# EAGLE board Adafruit Proto Tripler PiCowbell (EAGLE 9.6.2)
REV: A
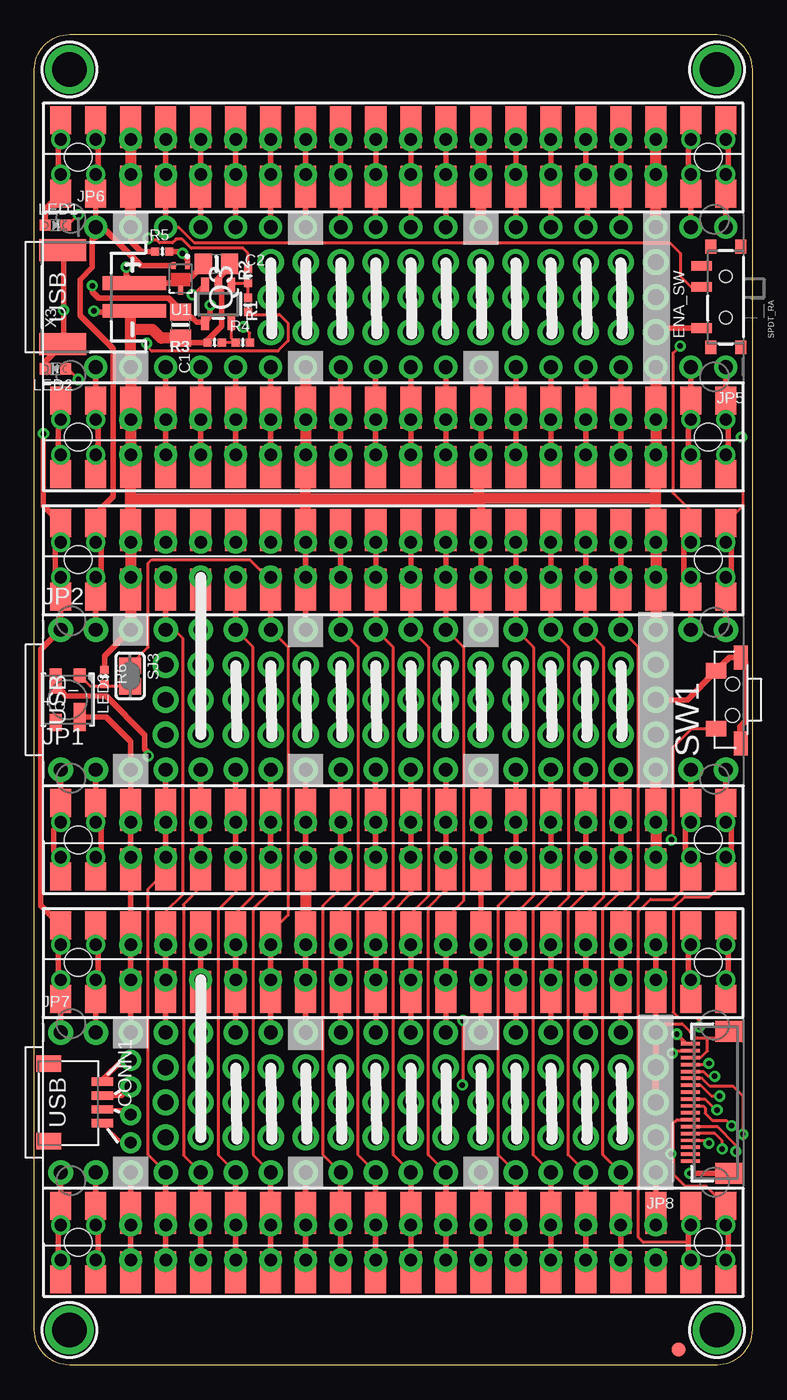
[diagram p1: board, top side]
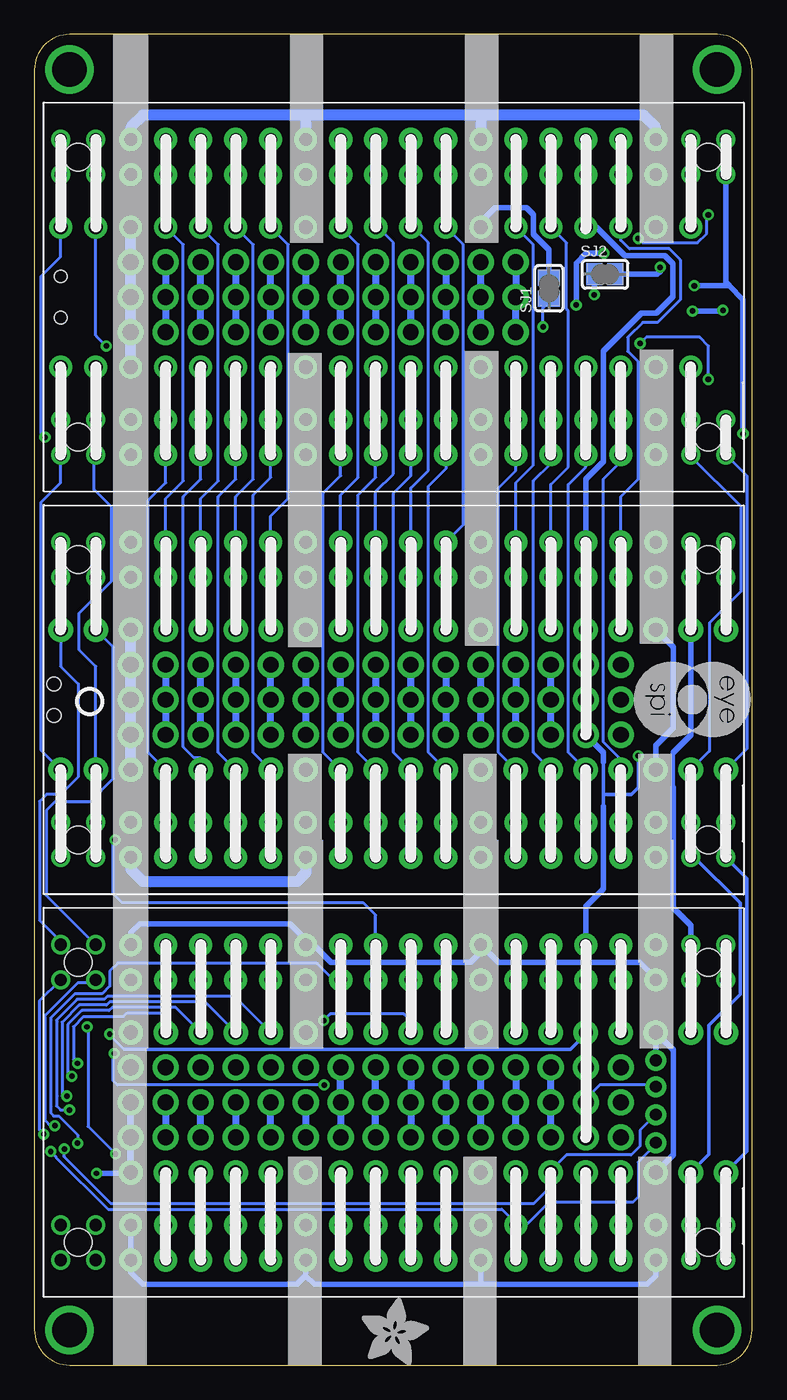
[diagram p2: board, bottom side, seen from below]

Size 52.07 x 96.52 mm. Coordinates in mm from the lower left corner, seen from the top.
Outline: 49.53,0 2.54,0 arc-90 0,2.54 0,93.98 arc-90 2.54,96.52 49.53,96.52 arc-90 52.07,93.98 52.07,2.54 arc-90 49.53,0
Copper layers (1*16): Top 0.035mm / dielectric 1.5mm / Bottom 0.035mm
Design rules "adafruit": minimum track width 8mil, minimum drill 15.5mil, track to track 8mil, track to pad 8mil, pad to pad 8mil, via to via 8mil, smd to smd 8mil, copper to edge 10mil, drill to drill 8mil, minimum pad ring 10mil, minimum via ring 8mil, stop-mask expansion 2mil, vias tented up to drill 20mil, thermal gap 10mil
Net classes: 1 GND: width 0.406 mm; 2 VBUS: width 0.406 mm; 3 VSYS: width 0.406 mm; 4 3V: width 0.406 mm

## Footprints (pad centres in the part's own frame; a part is rotated, then mirrored left to right if it is on the bottom)
0805-NO = smd 1.24 x 1.5: 1 -0.95,0; 2 0.95,0
PICOWBELL_DUALSMTTHM = smd 1.524 x 2.032: S1 -24.13,-12.829; S2 -24.13,-7.495; S3 -21.59,-12.829; S4 -21.59,-7.495; S37 21.59,-12.829; S38 21.59,-7.495; S39 24.13,-12.829; S40 24.13,-7.495; S41 24.13,12.829; S42 24.13,7.495; S43 21.59,12.829; S44 21.59,7.495; S77 -21.59,7.495; S78 -21.59,12.829; S79 -24.13,7.495; S80 -24.13,12.829 | smd 1.524 x 3.048: S5 -19.05,-12.321; S6 -19.05,-8.003; S7 -16.51,-12.321; S8 -16.51,-8.003; S9 -13.97,-12.321; S10 -13.97,-8.003; S11 -11.43,-12.321; S12 -11.43,-8.003; S13 -8.89,-12.321; S14 -8.89,-8.003; S15 -6.35,-12.321; S16 -6.35,-8.003; S17 -3.81,-12.321; S18 -3.81,-8.003; S19 -1.27,-12.321; S20 -1.27,-8.003; S21 1.27,-12.321; S22 1.27,-8.003; S23 3.81,-12.321; S24 3.81,-8.003; S25 6.35,-12.321; S26 6.35,-8.003; S27 8.89,-12.321; S28 8.89,-8.003; S29 11.43,-12.321; S30 11.43,-8.003; S31 13.97,-12.321; S32 13.97,-8.003; S33 16.51,-12.321; S34 16.51,-8.003; S35 19.05,-12.321; S36 19.05,-8.003; S45 19.05,8.003; S46 19.05,12.321; S47 16.51,8.003; S48 16.51,12.321; S49 13.97,8.003; S50 13.97,12.321; S51 11.43,8.003; S52 11.43,12.321; S53 8.89,8.003; S54 8.89,12.321; S55 6.35,8.003; S56 6.35,12.321; S57 3.81,8.003; S58 3.81,12.321; S59 1.27,8.003; S60 1.27,12.321; S61 -1.27,8.003; S62 -1.27,12.321; S63 -3.81,8.003; S64 -3.81,12.321; S65 -6.35,8.003; S66 -6.35,12.321; S67 -8.89,8.003; S68 -8.89,12.321; S69 -11.43,8.003; S70 -11.43,12.321; S71 -13.97,8.003; S72 -13.97,12.321; S73 -16.51,8.003; S74 -16.51,12.321; S75 -19.05,8.003; S76 -19.05,12.321 | drill 0.9 pad 1.27: T1 -24.13,-11.43; T2 -24.13,-8.89; T3 -21.59,-11.43; T4 -21.59,-8.89; T37 21.59,-11.43; T38 21.59,-8.89; T39 24.13,-11.43; T40 24.13,-8.89; T41 24.13,11.43; T42 24.13,8.89; T43 21.59,11.43; T44 21.59,8.89; T77 -21.59,11.43; T78 -21.59,8.89; T79 -24.13,11.43; T80 -24.13,8.89 | drill 0.9 pad 1.676: T5 -19.05,-11.43; T6 -19.05,-8.89; T7 -16.51,-11.43; T8 -16.51,-8.89; T9 -13.97,-11.43; T10 -13.97,-8.89; T11 -11.43,-11.43; T12 -11.43,-8.89; T13 -8.89,-11.43; T14 -8.89,-8.89; T15 -6.35,-11.43; T16 -6.35,-8.89; T17 -3.81,-11.43; T18 -3.81,-8.89; T19 -1.27,-11.43; T20 -1.27,-8.89; T21 1.27,-11.43; T22 1.27,-8.89; T23 3.81,-11.43; T24 3.81,-8.89; T25 6.35,-11.43; T26 6.35,-8.89; T27 8.89,-11.43; T28 8.89,-8.89; T29 11.43,-11.43; T30 11.43,-8.89; T31 13.97,-11.43; T32 13.97,-8.89; T33 16.51,-11.43; T34 16.51,-8.89; T35 19.05,-11.43; T36 19.05,-8.89; T45 19.05,11.43; T46 19.05,8.89; T47 16.51,11.43; T48 16.51,8.89; T49 13.97,11.43; T50 13.97,8.89; T51 11.43,11.43; T52 11.43,8.89; T53 8.89,11.43; T54 8.89,8.89; T55 6.35,11.43; T56 6.35,8.89; T57 3.81,11.43; T58 3.81,8.89; T59 1.27,11.43; T60 1.27,8.89; T61 -1.27,11.43; T62 -1.27,8.89; T63 -3.81,11.43; T64 -3.81,8.89; T65 -6.35,11.43; T66 -6.35,8.89; T67 -8.89,11.43; T68 -8.89,8.89; T69 -11.43,11.43; T70 -11.43,8.89; T71 -13.97,11.43; T72 -13.97,8.89; T73 -16.51,11.43; T74 -16.51,8.89; T75 -19.05,11.43; T76 -19.05,8.89 | hole 2: -22.86,-10.16; 22.86,-10.16; 22.86,10.16; -22.86,10.16
JST_SH4 = smd 0.6 x 1.55: 1 -1.5,2.006; 2 -0.5,2.006; 3 0.5,2.006; 4 1.5,2.006 | smd 1.2 x 1.8: MT1 -2.8,-1.894; MT2 2.8,-1.894
SPDT_SMT_SSSS811101 = smd 0.7 x 1.5: A -2.25,1.242; B 0.75,1.242; C 2.25,1.242 | smd 1 x 0.8: SUP1 -3.65,0.592; SUP2 -3.65,-1.608; SUP3 3.65,0.592; SUP4 3.65,-1.608 | hole 0.9: -1.5,-0.508; 1.5,-0.508
FIDUCIAL_1MM = smd 1 x 1: 1 0,0
1X20_ROUND_70MIL = drill 1 pad 1.778: 1 -24.13,0; 2 -21.59,0; 3 -19.05,0; 4 -16.51,0; 5 -13.97,0; 6 -11.43,0; 7 -8.89,0; 8 -6.35,0; 9 -3.81,0; 10 -1.27,0; 11 1.27,0; 12 3.81,0; 13 6.35,0; 14 8.89,0; 15 11.43,0; 16 13.97,0; 17 16.51,0; 18 19.05,0; 19 21.59,0; 20 24.13,0
1X19_ROUND = drill 1 pad 1.676: 1 -22.86,0; 2 -20.32,0; 3 -17.78,0; 4 -15.24,0; 5 -12.7,0; 6 -10.16,0; 7 -7.62,0; 8 -5.08,0; 9 -2.54,0; 10 0,0; 11 2.54,0; 12 5.08,0; 13 7.62,0; 14 10.16,0; 15 12.7,0; 16 15.24,0; 17 17.78,0; 18 20.32,0; 19 22.86,0
1X18_ROUND70 = drill 1 pad 1.778: 1 -21.59,0; 2 -19.05,0; 3 -16.51,0; 4 -13.97,0; 5 -11.43,0; 6 -8.89,0; 7 -6.35,0; 8 -3.81,0; 9 -1.27,0; 10 1.27,0; 11 3.81,0; 12 6.35,0; 13 8.89,0; 14 11.43,0; 15 13.97,0; 16 16.51,0; 17 19.05,0; 18 21.59,0
CHIPLED_0603_NOOUTLINE = smd 0.8 x 0.8: A 0,-0.75; C 0,0.75
LED3535_FULLPADS = smd 1 x 0.85: 1 -1.75,0.875 | smd 1.8 x 0.85: 2 -1.35,-0.875 | smd 1.2 x 0.85: 3 1.65,-0.875 | smd 2 x 0.85: 4 1.25,0.875
DFN2015-3 = smd 0.5 x 0.31: 1 -0.95,0.5; 2 -0.95,-0.5 | smd 0.65 x 0.31: 3 0.825,0
_0402NO = smd 0.6 x 0.6: 1 -0.508,0; 2 0.508,0
SOLDERJUMPER_CLOSEDWIRE = smd 1.168 x 1.6: 1 -0.762,0; 2 0.762,0 | smd 0.635 x 0.203: WIRE 0,0
SPST_TACTILE_RA = smd 1.1 x 1.5: 1 2.1,-0.9; 2 -2.1,-0.9 | smd 1.75 x 1: MT1 3.175,0.9; MT2 -3.075,0.9 | hole 1: 1.15,0.3; -1.15,0.3
SOT23-5 = smd 0.55 x 1.2: 1 -0.95,-1.3; 2 0,-1.3; 3 0.95,-1.3; 4 0.95,1.3; 5 -0.95,1.3
MOUNTINGHOLE_2.5_PLATED = drill 2.5 pad 3.2: P$1 0,0
EYE_SPI_DISPLAY_SLIM = smd 0.25 x 1.4: 1 4.25,1.154; 2 3.75,1.154; 3 3.25,1.154; 4 2.75,1.154; 5 2.25,1.154; 6 1.75,1.154; 7 1.25,1.154; 8 0.75,1.154; 9 0.25,1.154; 10 -0.25,1.154; 11 -0.75,1.154; 12 -1.25,1.154; 13 -1.75,1.154; 14 -2.25,1.154; 15 -2.75,1.154; 16 -3.25,1.154; 17 -3.75,1.154; 18 -4.25,1.154 | smd 1.5 x 2: SUPPORT1 -5.15,-1.65; SUPPORT2 5.15,-1.65
JSTPH2_BATT = smd 1 x 4.6: 1 -1,-2.049; 2 1,-2.049 | smd 1.6 x 3.4: NC1 -3.4,3.151; NC2 3.4,3.151

## Placement (x,y rotation side)
C1  10uF  [0805-NO]  10.6,75.44 270 top
C2  10uF  [0805-NO]  13.21,79.88 0 top
CB1  PICOWBELL_DUALSMTTHM  [PICOWBELL_DUALSMTTHM]  26.04,48.26 0 top
CB2  PICOWBELL_DUALSMTTHM  [PICOWBELL_DUALSMTTHM]  26.04,77.47 0 top
CB3  PICOWBELL_DUALSMTTHM  [PICOWBELL_DUALSMTTHM]  26.04,19.05 0 top
CONN1  STEMMA_I2C_QT  [JST_SH4]  2.92,19.05 270 top
ENA_SW  SPDT_RA  [SPDT_SMT_SSSS811101]  49.66,77.47 90 top
FID2  FIDUCIAL_1MM  [FIDUCIAL_1MM]  46.74,1.14 0 top
JP1  [1X20_ROUND_70MIL]  26.04,43.18 0 top
JP2  [1X20_ROUND_70MIL]  26.04,53.34 0 top
JP5  [1X19_ROUND]  27.3,72.39 180 top
JP6  [1X19_ROUND]  27.3,82.55 0 top
JP7  [1X18_ROUND70]  23.5,24.13 0 top
JP8  [1X18_ROUND70]  23.5,13.97 180 top
LED1  ORANGE  [CHIPLED_0603_NOOUTLINE]  1.52,82.68 270 top
LED2  GREEN  [CHIPLED_0603_NOOUTLINE]  1.52,72.26 90 top
LED3  WS2812B_3535FULL  [LED3535_FULLPADS]  2.41,48.26 270 top
PLABEL0  [PLABEL0]  47.82,48.13 90 top
PLABEL1  [PLABEL1]  6.86,4.7 90 top
PLABEL2  [PLABEL2]  9.4,4.7 90 top
PLABEL3  [PLABEL3]  11.94,4.7 90 top
PLABEL4  [PLABEL4]  14.48,4.7 90 top
PLABEL5  [PLABEL5]  17.02,4.7 90 top
PLABEL6  [PLABEL6]  19.56,4.7 90 top
PLABEL7  [PLABEL7]  32.26,4.7 90 top
PLABEL8  [PLABEL8]  44.96,4.7 90 top
PLABEL9  [PLABEL9]  22.1,4.7 90 top
PLABEL10  [PLABEL10]  24.64,4.7 90 top
PLABEL11  [PLABEL11]  27.18,4.7 90 top
PLABEL12  [PLABEL12]  29.72,4.7 90 top
PLABEL13  [PLABEL13]  34.8,4.7 90 top
PLABEL14  [PLABEL14]  39.88,4.7 90 top
PLABEL15  [PLABEL15]  37.34,4.7 90 top
PLABEL16  [PLABEL16]  42.42,4.7 90 top
PLABEL36  [PLABEL36]  38.86,2.79 0 bottom
PLABEL37  [PLABEL37]  13.34,2.79 0 bottom
PLABEL38  [PLABEL38]  5.97,22.1 0 bottom
PLABEL39  [PLABEL39]  5.97,20.19 0 bottom
PLABEL40  [PLABEL40]  5.97,18.16 0 bottom
PLABEL41  [PLABEL41]  5.97,16.13 0 bottom
PLABEL42  [PLABEL42]  46.93,77.47 90 top
PLABEL43  [PLABEL43]  6.98,46.74 90 top
PLABEL44  [PLABEL44]  47.37,80.96 0 top
PLABEL45  [PLABEL45]  47.37,73.98 0 top
PLABEL48  [PLABEL48]  2.03,19.05 90 bottom
PLABEL49  [PLABEL49]  48.89,19.05 270 bottom
PLABEL50  [PLABEL50]  3.68,77.47 90 bottom
PLABEL51  [PLABEL51]  13.59,74.68 0 bottom
PLABEL52  [PLABEL52]  13.84,80.64 0 bottom
PLABEL59  [PLABEL17]  45.09,91.82 90 top
PLABEL60  [PLABEL18]  32.38,91.82 90 top
PLABEL61  [PLABEL19]  19.69,91.82 90 top
PLABEL62  [PLABEL20]  6.98,91.82 90 top
PLABEL63  [PLABEL21]  9.52,91.82 90 top
PLABEL64  [PLABEL22]  12.06,91.82 90 top
PLABEL65  [PLABEL23]  14.61,91.82 90 top
PLABEL66  [PLABEL24]  17.14,91.82 90 top
PLABEL67  [PLABEL25]  22.23,91.82 90 top
PLABEL68  [PLABEL26]  24.77,91.82 90 top
PLABEL69  [PLABEL27]  27.3,91.82 90 top
PLABEL70  [PLABEL28]  29.84,91.82 90 top
PLABEL71  [PLABEL29]  34.92,91.82 90 top
PLABEL72  [PLABEL30]  37.47,91.82 90 top
PLABEL73  [PLABEL31]  40.01,91.82 90 top
PLABEL74  [PLABEL32]  42.55,91.82 90 top
PLABEL75  [PLABEL33]  38.73,93.98 0 bottom
PLABEL76  [PLABEL34]  26.04,93.98 0 bottom
PLABEL77  [PLABEL35]  13.08,93.73 0 bottom
Q3  DMG3415UFY  [DFN2015-3]  10.6,78.8 270 top
R1  4.7K  [_0402NO]  15.49,78.99 270 top
R2  22K  [_0402NO]  15.49,76.9 90 top
R3  4.7K  [_0402NO]  13.08,74.17 180 top
R4  4.7K  [_0402NO]  15.11,74.17 0 top
R5  22K  [_0402NO]  9.27,80.77 0 top
R6  22K  [_0402NO]  5.08,49.91 270 top
SJ1  [SOLDERJUMPER_CLOSEDWIRE]  14.73,78.1 90 bottom
SJ2  [SOLDERJUMPER_CLOSEDWIRE]  10.67,79.12 0 bottom
SJ3  [SOLDERJUMPER_CLOSEDWIRE]  6.93,49.99 270 top
SW1  RA Tact  [SPST_TACTILE_RA]  50.36,48.26 270 top
U1  MCP73831T-2ACI/OT  [SOT23-5]  13.34,76.96 180 top
U$5  MOUNTINGHOLE2.5  [MOUNTINGHOLE_2.5_PLATED]  2.54,2.54 0 top
U$6  [PCBFEAT-REV-040]  48.07,48.13 180 bottom
U$7  MOUNTINGHOLE2.5  [MOUNTINGHOLE_2.5_PLATED]  49.53,2.54 0 top
U$10  [ADAFRUIT_5MM]  28.32,0 0 bottom
U$15  MOUNTINGHOLE2.5  [MOUNTINGHOLE_2.5_PLATED]  2.54,93.98 0 top
U$16  MOUNTINGHOLE2.5  [MOUNTINGHOLE_2.5_PLATED]  49.53,93.98 0 top
U$25  [EYESPI_MINI_LOGO]  8.64,51.05 270 bottom
X1  EYE_SPI_DISPLAY_SLIM  [EYE_SPI_DISPLAY_SLIM]  48.74,19.05 90 top
X3  JST_2PH  [JSTPH2_BATT]  5.21,77.47 90 top

## Tracks (layer width: path | path; a pad name or v marks a point on that pad's centre or on a via)
3.3V  (via drill 0.39, 0.85 pad 1.52, 1.14 pad 1.91)
  Top 0.305: X1.1 47.31,23.3 v46.61,24
  Top 0.406: CONN1.2 6.34,19.55 v6.98,20.19 | CB1.S71 JP2.5 | JP2.5 | CB1.S72 12.06,59.75 CB1.T71 | JP6.4 CB2.S71 | CB2.T71 CB2.S72 CB2.T72 | CB2.T71 | CB2.T72 | CB3.S71 JP7.5 | JP7.5 | LED3.2 2.25,48.51 5.21,48.51 8,45.72 8,44.7 8.25,44.45 v8.25,44.2 | CB3.S71 | CB3.S71 CB3.T71
  Top 0.813: JP2.5 | v12.06,16.51 v12.06,19.05 v12.06,21.59 JP7.5 | JP7.5 | JP2.5 v12.06,50.8
  Bottom 0.203: v6.98,20.19 7.11,20.32 11.05,20.32 12.06,19.3 v12.06,19.05 | 46.61,23.95 45.55,22.9
  Bottom 0.254: 10.79,40.51 10.79,41.4 | 10.79,41.4 10.79,43.74 | v46.61,24 46.61,23.95 | JP7.5 12.06,24 13.17,22.9 45.55,22.9 | v8.25,44.2 8.25,41.91 8.76,41.4 10.79,41.4
  Bottom 0.406: JP6.4 11.3,82.55 9.22,80.47 6.33,80.47 5.74,79.88 5.74,77.51 6.96,76.29 8.04,76.29 10.79,73.54 10.79,65.53 12.06,64.26 CB1.T71 CB1.T72 | CB3.T71 12.06,33.27 10.79,34.54 10.79,40.51 | 10.79,43.74 10.79,44.45 v12.06,45.72 v12.06,48.26 v12.06,50.8
!EN
  Top 0.203: 10.29,82.55 10.45,82.55 11.59,81.41 46.1,81.41 46.86,80.64 46.86,78.99 47.64,78.22 ENA_SW.B | CB3.S74 9.52,32.89 10.78,34.15 10.78,52.72 10.03,53.47 9.52,53.47
  Top 0.254: JP6.3 10.29,82.55
  Top 0.406: JP2.4 9.52,53.47 CB1.S73 9.52,56.32 CB1.T74 | JP2.4 | CB1.S74 9.52,59.75 CB1.T73 | CB2.T73 CB2.S74 CB2.T74 | CB2.T73 | JP6.3 9.52,84.84 9.65,84.96 9.65,85.35 CB2.S73 CB2.T74 | CB2.T74 | CB3.T73 CB3.S74 CB3.T74 | CB3.T73 | CB3.S73 JP7.4 | CB3.S73 | CB3.S73 CB3.T74 | CB3.T74
  Bottom 0.203: CB1.T73 9.52,62.99 8.25,64.26 8.25,72.77 9.02,73.53 9.02,74.55 7.94,75.63 6.86,75.63 5.21,77.28 5.21,80.17 6.01,80.97 8.9,80.97 9.52,81.6 JP6.3
  Bottom 0.406: CB1.T73 CB1.T74
!RESET  (via drill 0.39)
  Top 0.203: JP2.11 28.57,52.07 28.57,34.04 27.3,32.77 CB3.S60 | CB3.S60 | v46.23,38.1 46.36,38.23 46.36,44.83 47.68,46.16 SW1.1
  Top 0.406: JP2.11 CB1.S59 27.3,57.21 | JP2.11 | CB1.T59 27.3,60.64 CB1.S60 27.3,57.21 | 27.3,57.21 CB1.T60 | CB2.S60 CB2.T59 | CB2.T59 | CB2.S59 CB2.T60 | CB2.T60 | CB2.S59 CB2.T59 | JP6.10 | JP6.10 CB2.S59 | JP7.11 | CB3.S60 CB3.T59 | CB3.T59 | CB3.S59 | CB3.S59 CB3.T60 | CB3.S59 CB3.T59 | CB3.T59 | CB3.S59 JP7.11
  Bottom 0.203: CB1.T59 27.3,63.37 26.04,64.64 26.04,81.41 27.3,82.68 | CB3.T59 27.3,32.64 28.19,33.53 45.72,33.53 46.36,34.16 46.36,38.1 v46.23,38.1
  Bottom 0.254: JP6.10 27.3,82.68
AD0  (via drill 0.39)
  Top 0.203: JP2.10 26.02,52.08 26.02,33.9 24.77,32.64 24.77,31.62 | v31.09,24.99 31.09,22.12 31.1,22.11 31.1,20.37 v31.05,20.32 | v46.28,22.61 46.41,22.61 46.6,22.8 X1.2
  Top 0.406: CB1.S61 JP2.10 | JP2.10 | CB1.T61 24.77,60.64 CB1.S62 24.77,57.21 CB1.T62 | CB2.T61 CB2.S62 CB2.T62 | CB2.T61 | CB2.T62 | CB2.T62 CB2.S61 JP6.9 | JP7.10 | JP7.10 CB3.S61 | CB3.S61 | CB3.S61 CB3.T62 | CB3.S61 CB3.T61 | CB3.T61 | CB3.T61 CB3.S62 24.77,31.62
  Top 0.508: CB1.S61 24.77,56.32 CB1.T62
  Bottom 0.203: CB1.T61 24.77,63.63 23.5,64.9 23.5,81.41 24.64,82.55 JP6.9 | JP7.10 24.77,24.95 25.27,25.46 30.62,25.46 v31.09,24.99 | v31.05,20.32 46.04,20.32 46.38,20.66 46.38,22.5 v46.28,22.61
AD1
  Top 0.203: JP2.9 23.5,52.07 23.5,34.16 22.23,32.89 CB3.S64
  Top 0.406: CB1.S63 JP2.9 | JP2.9 | CB1.S64 22.23,60.64 CB1.T63 22.23,59.75 CB1.S63 | CB1.S63 22.23,56.32 CB1.T64 | CB2.T63 | CB2.T63 CB2.S64 CB2.T64 | CB2.T64 | CB2.T64 CB2.S63 JP6.8 | JP7.9 | CB3.T64 | 22.23,26.29 | 22.23,26.29 JP7.9 | JP7.9 | CB3.S63 22.23,26.29 | CB3.S64 CB3.T63 | CB3.T63 | CB3.S63 CB3.T64 | CB3.S63 CB3.T63
  Bottom 0.203: CB1.T63 20.95,60.96 20.95,81.28 JP6.8
AD2
  Top 0.203: JP2.7 18.41,52.07 18.41,32.64 CB3.S68 | SJ3.1 8.25,52.07 8.25,58.17 8.51,58.42 15.62,58.42 16.83,57.21 17.14,57.21
  Top 0.406: CB1.S67 JP2.7 | JP2.7 | CB1.S68 17.14,59.75 CB1.T67 | 17.14,57.21 CB1.T68 | JP6.6 | CB2.S67 JP6.6 | CB2.T67 CB2.S68 CB2.T68 | CB2.T67 | CB2.T68 | JP7.7 CB3.S67 | CB3.S67 CB3.T68 CB3.T67 | CB3.S67
  Bottom 0.203: CB1.T67 17.14,64.01 15.88,65.28 15.88,81.28 JP6.6
  Bottom 0.406: CB1.T67 CB1.T68
GND  (via drill 0.39, 0.4, 0.85 pad 1.52, 1.14 pad 1.91)
  Top 0.203: JP7.18 45.71,24.75 47,24.75 48.01,23.75 48.83,23.75 | X1.SUPPORT2 49.94,23.75 48.83,23.75 | X1.3 48.35,22.3 48.83,22.78 48.83,23.75
  Top 0.406: SW1.MT1 51.26,45.27 51.19,45.34 51.19,46.29 51.61,46.71 51.61,50.98 SW1.MT2 50.43,51.34 SW1.2 47.36,48.26 v45.09,48.26 | CB1.S6 6.98,40.2 CB1.T6 | CB1.S6 6.98,36.77 | 6.98,36.77 CB1.T5 | 6.98,36.77 CB1.S5 CB3.S76 | CB1.T16 19.69,40.2 CB1.S16 JP1.8 | CB1.T15 19.69,35.88 CB1.S15 CB1.T16 | CB1.T16 | 32.38,36.77 CB1.T25 | 32.38,36.77 CB1.S25 CB3.S56 | CB1.T36 45.09,40.2 CB1.S36 | CB1.S35 45.09,35.88 CB1.T35 | JP1.8 | CB1.S6 6.98,43.1 | CB1.S55 JP2.13 | JP2.13 | CB1.S65 JP2.8 | JP2.8 | JP2.3 | CB1.S76 6.98,59.75 CB1.T75 | 6.98,57.21 CB1.T76 | CB1.T66 19.69,57.21 19.69,59.75 | CB1.S46 45.09,59.75 CB1.T45 | 45.09,57.21 CB1.T46 | CB1.T55 32.38,59.75 CB1.S56 32.38,57.21 CB1.T56 | 19.69,59.75 19.69,59.82 CB1.S66 | 19.69,59.75 CB1.T65 | CB1.S26 32.38,40.2 CB1.T26 | CB1.S26 32.38,36.77 | CB1.S26 32.38,40.2 JP1.13 | CB2.S5 CB2.T5 | CB2.T5 | CB2.S16 | 19.69,64.52 CB2.S15 CB2.T15 | 19.69,64.52 | CB2.T15 | CB2.S16 CB2.T16 | CB2.S16 | CB2.T25 CB2.S25 CB2.T26 | CB2.T25 | CB2.S35 CB2.T35 | 6.98,84.84 7.11,84.96 7.18,84.9 7.18,85.28 CB2.S75 | CB2.S76 CB2.T75 | CB2.T75 | CB2.T65 CB2.S66 CB2.T66 | CB2.T65 | JP6.7 CB2.S65 CB2.T66 | JP6.7 | CB2.T66 | CB2.S45 CB2.T46 | CB2.T46 | CB2.T45 | CB2.S46 CB2.T45 | CB2.S26 32.38,70.1 | 32.38,70.1 | 32.38,70.1 CB2.T26 | CB2.T26 | JP5.8 32.38,70.1 | CB2.S75 | CB2.S75 CB2.T76 | CB2.T76 | C2.2 14.16,79.63 13.34,78.81 U1.2 13.59,78.01 13.59,75.37 12.57,74.36 R3.2 11.3,74.17 10.98,74.49 C1.2 | LED2.C 0.77,72.79 X3.NC1 2.12,74.13 v2.12,76.52 2.12,80.81 X3.NC2 | v4.32,76.45 4.38,76.39 6.03,76.39 6.22,76.2 6.98,76.2 | R5.1 7.75,80.77 6.98,81.53 JP6.2 | v6.98,22.1 6.35,22.1 4.93,20.67 CONN1.1 | JP8.1 | JP8.16 CB3.S6 | CB3.S6 CB3.T6 CB3.T5 | CB3.S6 | CB3.S5 CB3.T5 | CB3.T5 | CB3.T15 CB3.T16 19.69,11.56 19.81,11.68
  Top 0.406: CB3.S16 19.81,11.17 19.81,11.68 | JP8.11 19.69,11.81 19.81,11.68 | CB3.S25 CB3.T25 | CB3.S26 | CB3.S26 CB3.T26 | CB3.S26 CB3.T25 | CB3.T25 | CB3.S26 JP8.6 | JP8.6 | CB3.S36 CB3.T36 | CB3.S36 JP8.1 | CB3.T45 CB3.S46 CB3.T46 | CB3.T45 | CB3.T65 CB3.S66 CB3.T66 | CB3.T65 | CB3.T66 | CB3.T66 CB3.S65 JP7.8 | JP7.3 6.98,26.29 7.24,26.54 7.24,26.8 CB3.S75 | CB3.T55 | CB3.S56 CB3.T55 | CB3.S36 | CB3.S35 CB3.T35 | CB3.T35 | CB3.T46 | CB3.S45 | CB3.S45 CB3.T46 | CB3.S45 JP7.18 v45.09,21.59 | CB3.S55 JP7.13 | CB3.S55 | CB3.S55 CB3.T56 | CB3.S55 CB3.T55 | CB3.S15 CB3.T15 | CB3.T15 | CB3.S56 | X1.SUPPORT1 v47.57,13.9 v47.56,13.91 | CB3.S75 | CB3.S75 CB3.T76 | CB3.S76 | CB3.S76 CB3.T75 | CB3.T75 | CB3.S76 CB3.T76 | CB3.T76 | LED3.4 5.19,47.01 6.98,45.22 JP1.3 | ENA_SW.A 45.38,75.22 v45.09,74.93 | R6.1 5.08,51.43 JP2.3 | JP1.18 | JP2.18 | CB2.T6 | CB2.T56 | JP6.17
  Top 0.508: CB1.S45 45.09,56.32 CB1.T46 | CB1.S65 19.69,56.32 CB1.T66 | CB1.S75 6.98,56.32 CB1.T76 | CB1.S55 32.38,56.32 CB1.T56 | JP1.3 6.98,43.1 | 6.98,43.1 | v45.09,19.05 v45.09,21.59
  Top 0.61: CB1.S56 32.38,62.74
  Top 0.813: CB1.T36 CB1.T35 | CB1.S36 JP1.18 | CB1.S45 JP2.18 | CB1.S75 JP2.3 | CB1.S76 6.98,57.21 | 45.09,57.21 CB1.S46 45.09,62.86 | 19.69,59.82 19.69,62.86 | CB1.S76 | CB1.S76 6.98,62.86 | 6.98,62.86 19.69,62.86 | 19.69,62.86 32.26,62.86 | 32.26,62.86 32.38,62.74 | 45.09,62.86 32.26,62.86 | JP5.13 CB2.S16 | 19.69,62.86 19.69,64.52 | CB2.T16 CB2.T15 | 32.26,62.86 32.26,65.02 CB2.S25 | 45.09,62.86 CB2.S35 | CB2.S35 | JP6.2 6.98,84.84 | JP6.17 CB2.S45 CB2.T45 | CB2.S76 CB2.T76 | JP5.3 45.09,70.36 44.83,70.1 44.83,69.72 CB2.S36 | CB2.S36 CB2.T36 | CB2.T36 | CB2.S36 CB2.T35 | CB2.T35 | JP6.12 CB2.S55 CB2.T56 CB2.S56 CB2.T55 | CB2.T55 | 6.98,75.06 JP5.18 CB2.S6 CB2.T6 CB2.S5 6.98,62.86 | 6.98,75.06 6.98,76.2 X3.1 | C1.2 9.21,74.49 8.57,75.12 7.05,75.12 6.98,75.06 | CB1.S15 19.69,32.13 19.56,32 19.56,31.5 CB3.S66
  Bottom 0.406: CB1.S35 CB1.T35 | CB2.T75 CB2.S76 | CB2.S46 CB2.T45 | v2.12,76.52 2.18,76.45 v4.32,76.45 | SJ1.2 14.73,80.9 15.88,82.04 15.88,83.44 16.38,83.95 18.67,83.95 19.69,82.93 JP6.7 | CB3.T45 CB3.S46 44.45,32 33.53,32 32.38,30.86 CB3.T55 31.81,30.48 30.54,29.21 20.45,29.21 19.69,29.97 CB3.T65 18.41,29.21 8.13,29.21 6.98,28.07 CB3.T76 | 32.38,6.48 33.02,5.84 44.2,5.84 CB3.S35 CB3.T35 CB3.T36 | JP8.16 5.71,15.24 5.71,22.86 JP7.3 v6.98,22.1 | 32.38,6.48 31.75,5.85 30.66,5.85 20.07,5.84 19.81,5.84 | 32.38,6.48 CB3.T25 | 19.81,5.84 7.62,5.84 6.98,6.48 CB3.T5 | 19.81,5.84 19.69,5.97 CB3.T15 | v47.56,13.91 45.15,13.91 JP8.1 | JP2.3 5.71,52.07 5.71,46.23 6.98,44.96 JP1.3
  Bottom 0.508: v45.09,19.05 v45.09,16.51 JP8.1
  Bottom 0.813: CB1.T25 32.38,35.69 33.02,35.05 44.2,35.05 CB1.S35 | JP1.18 v45.09,45.72 v45.09,48.26 v45.09,50.8 JP2.18 | CB2.S76 7.87,90.68 19.56,90.68 | 32.26,90.68 44.2,90.68 CB2.S46 | JP5.3 v45.09,74.93 v45.09,77.47 v45.09,80.01 JP6.17 | 19.56,90.68 19.69,90.55 CB2.T65 | 19.56,90.68 32.26,90.68 | 32.26,90.68 32.38,90.55 CB2.T55
IO0
  Top 0.406: CB1.S1 1.91,36.77 CB1.T1 1.4,37.28 1.4,38.8 CB1.T2 1.91,40.2 CB1.S2 JP1.1 | JP1.1 | CB2.T1 1.91,66.52 1.72,66.71 1.72,67.91 1.91,68.1 CB2.T2 CB2.S2 | CB2.S1 CB2.T1 | CB2.T1 | CB2.S2 | CB3.S2 JP8.18 | JP8.18 | CB3.S1 CB3.T1 | CB3.T1 | CB3.T1 1.91,8.1 1.72,8.29 1.72,9.49 1.91,9.68 CB3.T2 CB3.S2 | CB3.S2
  Bottom 0.203: CB2.T1 0.38,64.52 0.38,44.7 JP1.1
  Bottom 0.254: JP8.18 0.38,15.49 0.38,35.31 CB1.T1
IO1
  Top 0.406: CB1.S4 4.45,40.2 CB1.T4 | CB1.S3 4.45,36.77 CB1.T3 4.83,37.15 4.83,40.32 CB1.S4 | CB1.S4 JP1.2 | JP1.2 | JP5.19 CB2.S4 | CB2.T3 4.45,66.52 4.63,66.71 4.63,67.91 4.45,68.1 CB2.T4 CB2.S4 | CB2.S3 CB2.T3 | CB2.T3 | CB2.S4 | CB3.S4 JP8.17 | JP8.17 | CB3.S4 CB3.T4 | CB3.T4 | CB3.S4 4.45,9.68 4.63,9.49 4.63,8.29 4.45,8.1 CB3.T3 | CB3.S3 CB3.T3 | CB3.T3
  Bottom 0.203: JP1.2 3.1,44.53 3.1,53.83 0.79,56.15 0.79,62.25 4.45,65.91 CB2.T3
  Bottom 0.254: CB1.T3 4.19,36.83 0.87,33.51 0.87,26.89 3.12,24.63 3.12,15.29 JP8.17
IO2
  Top 0.203: JP8.15 8.25,15.24 8.25,34.54 9.52,35.81 9.52,36.07
  Top 0.406: CB1.S7 9.52,36.07 9.52,36.77 | 9.52,36.77 CB1.T7 9.52,36.77 | CB1.S8 9.52,40.2 CB1.T8 | CB1.S8 9.52,36.77 | CB1.S8 JP1.4 | JP1.4 | JP5.17 CB2.S8 | CB2.S8 | CB2.S8 CB2.T8 | CB2.S8 CB2.T7 | CB2.T7 | CB2.S7 | CB2.S7 9.52,64.64 | 9.52,64.64 | 9.52,64.64 CB2.T7 | CB3.T7 CB3.S7 CB3.T8 | CB3.T7 | CB3.T8 | 9.52,11.56 9.65,11.68 9.65,11.81 9.52,11.68 9.52,11.56 | 9.52,11.56 CB3.S8 CB3.T8 | JP8.15 9.52,11.56 | 9.52,11.56
  Bottom 0.203: JP1.4 9.52,43.94 10.79,45.21 10.79,64.26 9.52,65.53 CB2.T7
IO3
  Top 0.203: JP8.14 10.81,15.23 10.81,33.41 12.06,34.67 CB1.S9
  Top 0.406: CB1.S9 12.06,36.77 CB1.T9 CB1.T10 12.06,40.2 CB1.S10 JP1.5 | JP1.5 | JP5.16 | CB2.S9 CB2.T9 | CB2.T9 | CB2.S10 | CB2.S10 CB2.T10 | CB2.S10 CB2.T9 | CB2.S10 JP5.16 | JP8.14 CB3.S10 | CB3.S10 CB3.T10 CB3.T9 CB3.S9 | CB3.S10 | CB3.S9
  Bottom 0.203: JP1.5 13.34,44.45 13.34,63.88 CB2.S9 CB2.T9
IO4  (via drill 0.39, 0.85 pad 1.52)
  Top 0.203: CONN1.3 6.47,18.55 6.86,18.16 v6.98,18.16 | CB1.S11 14.61,34.29 13.34,33.02 13.34,15.24 JP8.13 | v49.9,15.68 49.9,16.25 49.35,16.8 X1.14
  Top 0.406: CB1.T11 14.61,36.77 CB1.S11 14.61,39.31 CB1.T12 14.61,40.2 CB1.S12 JP1.6 | JP1.6 | CB2.S12 JP5.15 | CB2.S12 | CB2.S12 CB2.T12 | CB2.S12 CB2.T11 | CB2.T11 | CB2.S11 CB2.T11 | CB2.T11 | CB3.T11 CB3.S11 CB3.T12 | CB3.T11 | CB3.T12 | CB3.S12 | CB3.S12 CB3.T12 | JP8.13 CB3.S12
  Bottom 0.203: JP1.6 15.86,44.44 15.86,64.15 14.61,65.41 CB2.T11 | v6.98,18.16 8.13,17.02 8.13,15.88 8.76,15.24 13.46,15.24 14.61,14.1 JP8.13 14.61,12.95 15.85,11.71 46.5,11.71 49.9,15.11 v49.9,15.68
IO5  (via drill 0.39, 0.85 pad 1.52)
  Top 0.203: CONN1.4 6.35,16.13 v6.98,16.13 | JP8.12 15.88,15.24 15.88,33.08 17.16,34.36 | CB1.S13 17.14,36.32 | 17.14,36.32 | X1.13 49.53,17.3 50.89,15.94 v50.89,15.49
  Top 0.406: 17.14,35.88 17.14,36.32 CB1.T13 CB1.T14 17.14,40.2 CB1.S14 JP1.7 | CB1.S13 17.14,35.88 | 17.14,35.88 17.16,34.36 | JP1.7 | JP5.14 | CB2.T13 CB2.S13 CB2.T14 | CB2.T13 | CB2.T14 | CB2.T14 CB2.S14 JP5.14 | JP8.12 CB3.S14 | CB3.S14 | CB3.S14 CB3.T14 | CB3.S14 CB3.T13 | CB3.T13 | CB3.S13 CB3.T13
  Bottom 0.203: JP1.7 18.41,44.45 18.41,63.63 17.14,64.9 CB2.T13 | v6.98,16.13 6.98,16 8.25,14.73 8.25,12.19 8.64,11.81 14.73,11.81 16.38,10.16 CB3.T14 17.14,10.29 18.16,11.3 46.74,11.3 50.51,15.08 50.51,15.11 v50.89,15.49
IO6
  Top 0.203: JP8.10 20.95,15.24 20.95,33.34 22.23,34.62
  Top 0.406: 22.23,35.88 CB1.T17 CB1.T18 22.23,40.2 CB1.S18 JP1.9 | CB1.S17 22.23,35.88 | 22.23,35.88 22.23,34.62 | JP1.9 | CB2.S17 CB2.T17 | CB2.T17 | JP5.12 CB2.S18 | CB2.S18 | CB2.S18 CB2.T18 | CB2.S18 CB2.T17 | CB3.T17 CB3.T18 CB3.S18 | CB3.S18 22.35,11.17 22.35,12.06 22.23,11.94 22.23,11.68 | 22.23,11.68 CB3.S18 | JP8.10 22.23,11.68 | 22.23,11.68 | CB3.S18 | CB3.S17 CB3.T17 | CB3.T17
  Bottom 0.203: JP1.9 23.5,44.45 23.5,63.75 22.23,65.02 CB2.T17
IO7
  Top 0.203: JP8.9 23.5,15.24 23.5,33.08 24.77,34.36
  Top 0.406: CB1.S19 24.77,35.88 | 24.77,35.88 24.77,34.36 | 24.77,35.88 CB1.T19 CB1.T20 24.77,40.2 | CB1.S20 24.77,40.2 | 24.77,40.2 JP1.10 | CB2.S19 CB2.T19 | CB2.T19 | JP5.11 CB2.S20 | CB2.S20 | CB2.S20 CB2.T20 | CB2.S20 CB2.T19 | JP8.9 24.77,11.68 24.89,11.56 24.89,11.17 CB3.S20 | CB3.S20 | CB3.S20 CB3.T20 | CB3.T19 CB3.S19 CB3.T20 | CB3.T19 | CB3.T20
  Bottom 0.203: JP1.10 26.04,44.45 26.04,63.25 24.77,64.52 CB2.T19
IO8
  Top 0.203: JP8.8 26.04,15.24 26.04,32.96 27.32,34.24
  Top 0.406: 27.3,40.2 CB1.T22 | CB1.S21 27.3,35.88 | 27.3,35.88 27.32,34.24 | 27.3,35.88 CB1.T21 27.3,36.77 CB1.S22 27.3,40.2 | JP1.11 27.3,40.2 | CB2.S22 | CB2.S22 CB2.T22 | CB2.S22 CB2.T21 | CB2.T21 | CB2.S21 CB2.T21 | JP5.10 27.3,70.23 27.43,70.1 27.43,69.59 CB2.S22 | CB3.T22 | JP8.8 CB3.S22 CB3.T22 | CB3.T21 CB3.S21 CB3.T22 | CB3.T21
  Bottom 0.203: JP1.11 28.57,44.45 28.57,63.12 27.3,64.39 CB2.T21
IO9
  Top 0.203: JP8.7 28.57,15.24 28.57,33.21 29.85,34.49
  Top 0.406: CB1.S23 29.84,35.88 | 29.84,35.88 29.85,34.49 | 29.84,35.88 CB1.T23 29.84,36.77 CB1.S24 | CB1.S24 29.84,40.2 CB1.T24 | CB1.S24 JP1.12 | JP1.12 | CB2.S23 CB2.T23 | CB2.T23 | CB2.T23 | CB2.S24 JP5.9 | CB2.S24 | CB2.S24 CB2.T24 | CB2.S24 CB2.T23 | JP8.7 CB3.S24 CB3.T24 | CB3.T24 | CB3.T23 CB3.S23 CB3.T24 | CB3.T23
  Bottom 0.203: JP1.12 31.12,44.45 31.12,63.25 29.84,64.52 CB2.T23
IO10
  Top 0.203: JP8.5 33.66,15.24 33.66,33.34 34.93,34.62
  Top 0.406: 34.92,35.88 CB1.S27 34.92,39.31 CB1.T28 34.92,40.2 CB1.S28 JP1.14 | 34.92,35.88 34.93,34.62 | 34.92,35.88 CB1.T27 | JP1.14 | CB2.S27 CB2.T27 | CB2.T27 | JP5.7 CB2.S28 | CB2.S28 | CB2.S28 CB2.T28 | CB2.S28 CB2.T27 | CB3.S28 | CB3.S28 CB3.T28 | CB3.T28 | CB3.S28 JP8.5 | JP8.5 | CB3.T27 CB3.S27 CB3.T28 | CB3.T27
  Bottom 0.203: JP1.14 36.2,44.45 36.2,63.12 34.92,64.39 CB2.T27
IO11
  Top 0.203: JP8.4 36.2,15.24 36.2,33.02 37.47,34.29 37.47,35.88
  Top 0.406: CB1.T29 37.47,35.88 CB1.S29 37.47,39.31 CB1.T30 37.47,40.2 CB1.S30 JP1.15 | JP1.15 | JP5.6 | CB2.T29 CB2.S29 CB2.T30 | CB2.T29 | CB2.T30 | CB2.T30 CB2.S30 37.47,70.1 | 37.47,70.1 | 37.47,70.1 JP5.6 | CB3.S30 | CB3.S30 CB3.T30 | CB3.S30 JP8.4 | JP8.4 | CB3.S30 CB3.T29 | CB3.T29 | CB3.S29 CB3.T29
  Bottom 0.203: JP1.15 38.73,44.45 38.73,62.99 37.47,64.26 CB2.T29
IO12
  Top 0.203: JP8.3 38.73,15.24 38.73,33.02 40.01,34.29 40.01,35.88
  Top 0.406: CB1.S31 40.01,35.88 CB1.T31 CB1.T32 40.01,40.2 CB1.S32 JP1.16 | JP1.16 | CB2.S31 CB2.T31 | CB2.T31 | JP5.5 CB2.S32 | CB2.S32 | CB2.S32 CB2.T32 | CB2.S32 CB2.T31 | CB2.T31 | CB3.S32 | CB3.S32 CB3.T32 | CB3.T32 | CB3.S32 JP8.3 | CB3.T31 CB3.S31 CB3.T32 | CB3.T31
  Bottom 0.203: JP1.16 40.01,44.03 40.48,44.03 41.27,44.83 41.27,62.99 40.01,64.26 CB2.T31
IO13
  Top 0.203: JP8.2 41.26,15.25 41.26,33.07 42.55,34.36
  Top 0.406: 42.55,35.88 CB1.S33 42.55,39.31 CB1.T34 42.55,40.2 CB1.S34 JP1.17 | 42.55,35.88 42.55,34.36 | 42.55,35.88 CB1.T33 | JP1.17 | CB2.S34 JP5.4 | JP5.4 | CB2.S33 CB2.T33 | CB2.T33 | CB2.S34 | CB2.S34 CB2.T34 | CB2.S34 CB2.T33 | CB3.T33 CB3.S33 CB3.T34 | CB3.T33 | CB3.S34 | CB3.S34 CB3.T34 | CB3.T34 | CB3.S34 JP8.2 | JP8.2
  Bottom 0.203: JP1.17 43.81,44.45 43.81,62.74 42.55,64.01 CB2.T33
IO14
  Top 0.203: CB1.S37 47.62,35.05 46.36,33.78 44.7,33.78 43.81,32.89 43.81,9.27 44.2,8.89 47.31,8.89 47.44,9.02
  Top 0.406: CB1.S37 47.62,35.88 CB1.T37 47.24,37.15 47.24,38.93 CB1.T38 47.62,40.2 CB1.S38 JP1.19 | JP1.19 | CB2.S38 JP5.2 | JP5.2 | CB2.S38 CB2.T38 47.62,68.1 47.44,67.91 47.44,66.71 47.62,66.52 CB2.T37 | CB2.S38 | CB2.S37 CB2.T37 | CB2.T37 | CB3.S38 | CB3.S38 CB3.T38 47.62,9.68 47.44,9.49 47.44,9.02 47.44,8.29 47.62,8.1 CB3.T37 | CB3.S37 CB3.T37 | CB3.T37
  Bottom 0.203: JP1.19 47.62,50.67 48.82,51.87 48.82,54.56 47.24,56.14 47.21,56.14 46.48,56.87 46.48,62.23 47.75,63.5 47.75,65.91 CB2.T37
IO15  (via drill 0.39)
  Top 0.203: CB3.S40 48.77,12.95 47.24,12.95 46.36,13.84 46.36,15.13 v46.18,15.3 46.36,15.48 46.36,17.53 46.63,17.8 X1.12 | CB1.S39 50.16,35.18 48.96,33.97 47.18,33.97 46.36,33.15 46.36,25.59 46.78,25.16 48.06,25.16 48.25,24.97 v48.25,24.53
  Top 0.406: CB1.T39 50.16,36.77 CB1.S39 50.55,35.75 50.55,38.93 CB1.T40 50.16,39.31 CB1.S40 JP1.20 | JP1.20 | JP5.1 | CB2.S40 JP5.1 | CB2.T39 50.16,66.52 50.35,66.71 50.35,67.91 50.16,68.1 CB2.T40 | CB3.T39 50.16,8.1 50.35,8.29 50.35,9.49 50.16,9.68 CB3.T40 CB3.S40 | CB3.S40 | CB3.S39 CB3.T39 | CB3.T39
  Bottom 0.203: JP1.20 51.56,44.58 51.56,62.61 50.16,64.01 CB2.T39 | v48.25,24.53 48.18,24.53 48.18,17.3 v46.18,15.3
IO16  (via drill 0.39, 0.4)
  Top 0.203: CB1.S41 51.44,62.36 51.44,67.18 v51.31,67.31 | v51.4,16.74 51.4,19.53 50.7,20.23 49.01,20.23 48.44,20.8 X1.6
  Top 0.406: JP2.20 CB1.S42 50.16,57.21 | JP2.20 | CB1.T41 50.16,59.75 CB1.S41 50.55,60.77 50.55,57.21 50.16,57.21 | 50.16,57.21 CB1.T42 | CB2.T41 50.16,88.42 50.35,88.23 50.35,87.03 50.16,86.84 CB2.T42 CB2.S42 | JP6.19 CB2.S42 | CB2.S42 | CB2.S41 CB2.T41 | CB2.T41 | CB3.T42 50.16,28.42 50.35,28.61 50.35,29.81 50.16,30 CB3.T41 | CB3.S42 CB3.T42 | CB3.T42 | CB3.T41 | CB3.S41 CB3.T41
  Bottom 0.203: v51.31,67.31 51.56,67.56 51.56,78.99 50.16,80.39 JP6.19 | JP2.20 50.16,50.67 48.89,49.4 48.89,42.67 50.16,41.4 51.18,41.4 51.69,40.89 51.69,32.26 50.16,30.73 CB3.T41 | v51.4,16.74 51.71,17.05 51.71,26.4 CB3.T42
IO17  (via drill 0.39, 0.4)
  Top 0.203: CB1.S43 47.62,61.98 46.36,63.25 46.36,73.41 v46.86,73.91 | X1.10 48.52,18.8 48.67,18.65 48.67,18.27 49.2,17.74 50.2,17.74 v50.58,17.36
  Top 0.406: JP2.19 CB1.S44 47.12,56.32 47.12,60.64 CB1.S43 47.62,60.64 CB1.T43 | JP2.19 | 47.62,57.21 CB1.T44 | CB2.S43 CB2.T43 | CB2.T43 | CB2.S44 | CB2.S44 CB2.T44 47.62,86.84 47.44,87.03 47.44,88.23 47.62,88.42 CB2.T43 | JP6.18 CB2.S44 | CB3.S44 | CB3.S44 CB3.T44 47.62,28.42 47.44,28.61 47.44,29.81 47.62,30 CB3.T43 | CB3.S43 CB3.T43 | CB3.T43
  Top 0.508: CB1.S44 47.62,57.21
  Bottom 0.203: v46.86,73.91 47.62,74.68 JP6.18 | CB3.T43 51.18,34.04 51.18,40.26 50.55,40.89 48.01,40.89 46.36,42.55 46.36,52.07 JP2.19 | v50.58,17.36 50.91,17.36 51.29,17.74 51.29,25.37 48.91,27.75 47.81,27.75 CB3.T44
IO18  (via drill 0.39)
  Top 0.203: CB3.S48 42.55,32.64 43.81,33.91 43.81,52.07 JP2.17 | X1.4 48.6,21.8 48.68,21.88 v48.95,21.88
  Top 0.406: CB1.S47 JP2.17 | JP2.17 | CB1.T47 42.55,59.75 CB1.S48 42.55,57.21 CB1.T48 | CB2.S48 CB2.T47 | CB2.T47 | CB2.S47 | CB2.S47 CB2.T48 | CB2.S47 CB2.T47 | JP6.16 CB2.S47 | CB3.S47 42.55,26.8 | 42.55,26.8 42.55,26.42 | 42.55,26.42 | 42.55,26.42 CB3.T48 | JP7.17 42.55,26.8 | 42.55,26.8 | CB3.T48 | CB3.T47 CB3.S48 CB3.T48 | CB3.T47
  Top 0.508: CB1.S47 42.55,57.21
  Bottom 0.203: CB1.T47 42.55,62.86 41.27,64.13 41.27,81.28 JP6.16 | v48.95,21.88 48.97,21.88 49.24,22.15 49.24,24.54 48.5,25.27 45.63,25.27 45.38,25.53 42.8,25.53 42.55,25.27 JP7.17
IO19  (via drill 0.39)
  Top 0.203: JP2.16 41.27,52.07 41.27,33.91 40.01,32.64 CB3.S50 | v49.35,20.95 48.88,20.95 48.54,21.3 X1.5
  Top 0.406: CB1.S49 JP2.16 | JP2.16 | CB1.T49 40.01,60.64 CB1.S50 40.01,57.21 CB1.T50 | JP6.15 40.13,82.68 40.13,84.84 40.26,84.96 40.01,85.22 CB2.S49 CB2.T50 | CB2.T49 CB2.S50 CB2.T50 | CB2.T49 | CB2.T50 | CB3.S49 40.01,26.8 | 40.01,26.8 40.01,26.42 | 40.01,26.42 | 40.01,26.42 CB3.T50 | JP7.16 40.01,26.8 | 40.01,26.8 | CB3.T50 | CB3.T49 CB3.S50 CB3.T50 | CB3.T49
  Top 0.508: CB1.S49 40.01,56.32 CB1.T50
  Bottom 0.203: CB1.T49 40.01,62.86 38.73,64.13 38.73,81.28 JP6.15 | v49.35,20.95 49.65,20.95 49.65,24.7 48.64,25.71 46.67,25.71 46.45,25.93 41.81,25.93 JP7.16
IO20  (via drill 0.39)
  Top 0.203: JP2.15 38.73,52.07 38.73,33.91 37.47,32.64 CB3.S52 | v49.72,19.51 49.14,19.51 48.34,20.3 X1.7
  Top 0.406: CB1.S51 JP2.15 | JP2.15 | CB1.T51 37.47,59.75 CB1.S52 37.47,57.21 CB1.T52 | JP6.14 | CB2.S51 JP6.14 | CB2.S52 CB2.T52 | CB2.T52 | CB3.T51 CB3.S52 CB3.T52 | CB3.T51 | CB3.T52 | CB3.S51 | CB3.S51 CB3.T52 | JP7.15 CB3.S51
  Bottom 0.203: CB1.T51 37.47,62.99 36.2,64.26 36.2,81.28 JP6.14 | v49.72,19.51 50.06,19.51 50.06,24.87 48.8,26.12 46.84,26.12 46.61,26.34 39.67,26.34 JP7.15
IO21  (via drill 0.39)
  Top 0.203: JP2.14 36.2,52.07 36.2,34.04 34.92,32.77 CB3.S54 | X1.9 48.63,19.3 49.43,18.5 v49.53,18.5
  Top 0.406: CB1.S53 JP2.14 | JP2.14 | CB1.T53 34.92,59.75 CB1.S54 34.92,57.21 CB1.T54 | CB2.T53 CB2.S54 CB2.T54 | CB2.T53 | CB2.T54 CB2.S53 JP6.13 | CB2.T54 | CB2.T54 | CB3.S53 JP7.14 | CB3.S53 | CB3.S53 CB3.T54 | CB3.T53 CB3.S54 CB3.T54 | CB3.T53 | CB3.T54
  Top 0.508: CB1.S53 34.92,56.32 CB1.T54
  Bottom 0.203: CB1.T53 34.92,61.59 33.66,62.86 33.66,81.28 JP6.13 | v49.53,18.5 50.16,18.5 50.46,18.8 50.46,25.03 48.97,26.52 47,26.52 46.78,26.75 37.54,26.75 JP7.14
IO22  (via drill 0.39)
  Top 0.203: JP2.12 31.12,52.07 31.12,33.66 29.72,32.26 29.72,31.5 CB3.S58 | X1.15 48.73,16.3 v48.94,16.09
  Top 0.406: CB1.S57 JP2.12 | JP2.12 | CB1.T57 29.84,60.64 CB1.S58 29.84,57.21 CB1.T58 | JP6.11 | CB2.S57 JP6.11 | CB2.T57 CB2.S58 CB2.T58 | CB2.T57 | CB2.T58 | CB3.S57 JP7.12 | JP7.12 | CB3.T57 CB3.S58 CB3.T58 | CB3.T57 | CB3.T58
  Bottom 0.203: CB1.T57 29.84,63.12 28.57,64.39 28.57,81.28 JP6.11 | CB3.T58 30.35,27.94 31.56,29.15 46.04,29.15 46.61,28.57 46.61,27.49 47.17,26.93 49.14,26.93 50.88,25.19 50.88,18.28 50.67,18.07 50.29,18.07 48.94,16.71 v48.94,16.09
N$1  (via drill 0.4)
  Top 0.203: R4.2 15.62,74.86 v15.17,75.31
  Bottom 0.203: v15.17,75.31 15.17,76.65 SJ1.1
N$2  (via drill 0.4)
  Top 0.406: U1.3 12.32,78.26 11.78,77.72 11.37,77.72 v11.45,77.64
  Bottom 0.406: v11.45,77.64 11.45,79.1 SJ2.1
N$3  (via drill 1.14 pad 1.91)
  other vias: 9.52,16.51
N$4  (via drill 0.4)
  Top 0.203: R1.1 15.49,80.64 15.14,81 11.38,81 10.71,81.68 10.27,81.68 10,81.41 9.05,81.41 8.88,81.58 8.4,81.58 v8.25,81.72 | v3.18,83.44 2.41,82.68 LED1.C
  Bottom 0.203: v3.18,83.44 3.3,83.31 3.3,82.08 3.97,81.41 7.94,81.41 v8.25,81.72
N$5
  Top 0.203: U1.1 14.51,78.49 R1.2 R2.2
N$6  (via drill 1.14 pad 1.91)
  other vias: 9.52,19.05
N$7  (via drill 0.4)
  Top 0.203: R2.1 15.68,76.2 17.78,76.2 18.41,75.56 18.41,74.3 17.65,73.53 8.51,73.53 8.51,73.54 8.13,73.92 v8.13,74.11 | LED2.A 2.41,72.26 v3.18,71.5
  Bottom 0.203: v3.18,71.5 3.18,73.91 3.81,74.55 7.69,74.55 v8.13,74.11
N$8
  Top 0.203: U1.5 14.29,74.49 R4.1 R3.1
N$9  (via drill 1.14 pad 1.91)
  other vias: 9.52,21.59
N$11
  Top 0.203: SJ3.2 5.08,49.23 | 5.08,49.23 4.07,49.23 LED3.1 | R6.2 5.08,49.23
N$49  (via drill 1.14 pad 1.91)
  other vias: 9.52,45.72
N$50  (via drill 1.14 pad 1.91)
  other vias: 9.52,48.26
N$51  (via drill 1.14 pad 1.91)
  other vias: 9.52,50.8
PR1  (via drill 1.14 pad 1.91)
  Bottom 0.508: v14.61,45.72 v14.61,48.26 v14.61,50.8
PR2  (via drill 1.14 pad 1.91)
  Bottom 0.508: v17.14,50.8 v17.14,48.26 v17.14,45.72
PR3  (via drill 1.14 pad 1.91)
  Bottom 0.508: v19.69,45.72 v19.69,48.26 v19.69,50.8
PR4  (via drill 1.14 pad 1.91)
  Bottom 0.508: v22.23,50.8 v22.23,48.26 v22.23,45.72
PR5  (via drill 1.14 pad 1.91)
  Bottom 0.508: v24.77,45.72 v24.77,48.26 v24.77,50.8
PR6  (via drill 1.14 pad 1.91)
  Bottom 0.508: v27.3,50.8 v27.3,48.26 v27.3,45.72
PR7  (via drill 1.14 pad 1.91)
  Bottom 0.508: v29.84,45.72 v29.84,48.26 v29.84,50.8
PR8  (via drill 1.14 pad 1.91)
  Bottom 0.508: v32.38,50.8 v32.38,48.26 v32.38,45.72
PR9  (via drill 1.14 pad 1.91)
  Bottom 0.508: v34.92,45.72 v34.92,48.26 v34.92,50.8
PR10  (via drill 1.14 pad 1.91)
  Bottom 0.508: v37.47,50.8 v37.47,48.26 v37.47,45.72
PR11  (via drill 1.14 pad 1.91)
  Bottom 0.508: v40.01,45.72 v40.01,48.26 v40.01,50.8
PR12  (via drill 1.14 pad 1.91)
  Bottom 0.508: v42.55,50.8 v42.55,48.26 v42.55,45.72
PR13  (via drill 1.14 pad 1.91)
  Bottom 0.508: v17.14,80.01 v17.14,77.47 v17.14,74.93
PR14  (via drill 1.14 pad 1.91)
  Bottom 0.508: v19.69,74.93 v19.69,77.47 v19.69,80.01
PR15  (via drill 1.14 pad 1.91)
  Bottom 0.508: v22.23,80.01 v22.23,77.47 v22.23,74.93
PR16  (via drill 1.14 pad 1.91)
  Bottom 0.508: v24.77,74.93 v24.77,77.47 v24.77,80.01
PR17  (via drill 1.14 pad 1.91)
  Bottom 0.508: v27.3,80.01 v27.3,77.47 v27.3,74.93
PR18  (via drill 1.14 pad 1.91)
  Bottom 0.508: v29.84,74.93 v29.84,77.47 v29.84,80.01
PR19  (via drill 1.14 pad 1.91)
  Bottom 0.508: v32.38,80.01 v32.38,77.47 v32.38,74.93
PR20  (via drill 1.14 pad 1.91)
  Bottom 0.508: v34.92,74.93 v34.92,77.47 v34.92,80.01
PR21  (via drill 1.14 pad 1.91)
  Bottom 0.508: v37.47,80.01 v37.47,77.47 v37.47,74.93
PR22  (via drill 1.14 pad 1.91)
  Bottom 0.508: v40.01,74.93 v40.01,77.47 v40.01,80.01
PR23  (via drill 1.14 pad 1.91)
  Bottom 0.508: v42.55,80.01 v42.55,77.47 v42.55,74.93
PR24  (via drill 1.14 pad 1.91)
  Bottom 0.508: v17.14,21.59 v17.14,19.05 v17.14,16.51
PR25  (via drill 1.14 pad 1.91)
  Bottom 0.508: v19.69,16.51 v19.69,19.05 v19.69,21.59
PR26  (via drill 1.14 pad 1.91)
  Bottom 0.508: v22.23,21.59 v22.23,19.05 v22.23,16.51
PR27  (via drill 1.14 pad 1.91)
  Bottom 0.508: v24.77,21.59 v24.77,19.05 v24.77,16.51
PR28  (via drill 1.14 pad 1.91)
  Bottom 0.508: v27.3,16.51 v27.3,19.05 v27.3,21.59
PR29  (via drill 1.14 pad 1.91)
  Bottom 0.508: v29.84,16.51 v29.84,19.05 v29.84,21.59
PR30  (via drill 1.14 pad 1.91)
  Top 0.508: v32.38,21.59 v32.38,19.05
  Bottom 0.508: v32.38,19.05 v32.38,16.51
PR31  (via drill 1.14 pad 1.91)
  Top 0.508: v34.92,19.05 v34.92,21.59
  Bottom 0.508: v34.92,16.51 v34.92,19.05
PR32  (via drill 1.14 pad 1.91)
  Top 0.508: v37.47,21.59 v37.47,19.05
  Bottom 0.508: v37.47,19.05 v37.47,16.51
PR33  (via drill 1.14 pad 1.91)
  Top 0.508: v40.01,19.05 v40.01,21.59
  Bottom 0.508: v40.01,16.51 v40.01,19.05
PR34  (via drill 1.14 pad 1.91)
  Top 0.508: v42.55,21.59 v42.55,19.05
  Bottom 0.508: v42.55,19.05 v42.55,16.51
PR35  (via drill 1.14 pad 1.91)
  Bottom 0.508: v14.61,16.51 v14.61,19.05 v14.61,21.59
VBAT  (via drill 0.4)
  Top 0.406: 10.45,78.52 10.6,78.36 Q3.3 | 10.45,78.52 10.35,78.61 10.21,78.47 X3.2 6.67,79.06 v6.67,79.63 | C2.1 12.26,79.82 10.95,78.52 10.45,78.52
  Bottom 0.406: v6.67,79.63 6.67,79.31 6.86,79.12 SJ2.2
VBUS  (via drill 0.4)
  Top 0.406: CB1.S79 1.91,54.74 | 1.91,54.74 | 1.91,54.74 JP2.1 2.03,53.21 1.78,53.21 0.46,51.89 0.46,33.33 CB3.S80 CB3.T79 1.72,30.29 1.72,28.61 1.91,28.42 CB3.T80 CB3.S79 | CB1.S79 1.91,57.21 CB1.T80 | CB1.S79 1.52,56.2 1.52,59.37 CB1.T79 1.91,59.75 CB1.S80 0.64,62.36 0.64,67.54 v0.66,67.56 | CB2.S80 CB2.T79 | CB2.T79 | CB2.T79 1.91,88.42 1.72,88.23 1.72,87.03 1.91,86.84 CB2.T80 CB2.S79 | CB2.S79 | LED1.A 0.77,83.83 CB2.S79 | v4.19,78.3 4.19,77.85 4.67,77.38 9.74,77.38 10.6,76.52 C1.1 11.02,76.39 11.75,75.66 U1.4 12.76,76.04 v12.76,76.9 | Q3.1 11.1,80.21 10.67,80.64 | 10.67,80.64 v10.74,80.64 | R5.2 10.54,80.77 10.67,80.64 | JP7.1 1.91,25.02 | CB3.S79 | CB3.S79 1.91,25.02 | 1.91,25.02
  Bottom 0.406: v4.19,78.3 1.65,78.3 | CB2.T80 1.91,78.55 1.65,78.3 | v0.66,67.56 0.66,77.3 1.65,78.3 | v10.74,80.64 12.06,80.64 12.76,79.95 v12.76,76.9
VREF
  Top 0.203: JP2.6 15.86,52.08 15.86,34.02 14.61,32.77 CB3.S70
  Top 0.406: JP2.6 CB1.S69 14.61,57.21 CB1.T70 | JP2.6 | CB1.S70 14.61,59.75 CB1.T69 | CB2.T69 CB2.S70 CB2.T70 | CB2.T69 | CB2.S69 | CB2.S69 CB2.T70 | CB2.S69 JP6.5 | JP6.5 | CB2.T70 | JP7.6 14.61,26.42 14.73,26.54 14.73,26.93 CB3.S69 CB3.T70 | CB3.T70 | CB3.T69 CB3.S70 CB3.T70 | CB3.T69 | CB3.T70
  Bottom 0.203: CB1.T69 14.61,63.88 13.34,65.15 13.34,76.47 13.47,76.6 13.47,81.42 JP6.5
  Bottom 0.406: CB1.T69 CB1.T70
VSYS
  Top 0.406: CB1.S77 JP2.2 | JP2.2 | CB1.S77 4.45,56.32 CB1.T78 | CB1.S77 4.83,56.2 4.83,59.75 4.45,59.75 | 4.45,59.75 CB1.T77 | 4.45,59.75 CB1.S78 4.45,61.72 5.71,62.99 5.71,73.72 3.3,76.14 3.3,78.74 4.19,79.63 4.19,82.04 4.45,81.79 JP6.1 | JP6.1 CB2.S77 | CB2.S78 CB2.T77 | CB2.T77 | CB2.T77 4.45,88.42 4.63,88.23 4.63,87.03 4.45,86.84 CB2.T78 CB2.S77 | CB2.S77 | JP6.1 4.45,83.06 7.75,79.75 Q3.2 | CB3.S78 CB3.T77 | CB3.T77 | CB3.T77 4.63,30.29 4.63,28.61 4.45,28.42 CB3.T78 CB3.S77 | CB3.S77 | JP7.2 CB3.S77
  Bottom 0.254: 5.71,44.45 5.71,41.91
  Bottom 0.406: 5.71,41.91 5.71,33.15 CB3.S78 CB3.T77 | JP2.2 4.45,45.72 5.71,44.45

## Text on the board
Pinguin_tBackup: GND | EN | 3.3V | VREF | AD2 | GND | AD1 | AD0 | RST | IO22 | GND | IO21 | IO20 | IO19 | IO18 | GND | VB | VS | 3V | Vr | A2 | A0 | R | 22 | 20 | 19 | 18 | 17 | 16 | I2C | G | On | 3 | Enable | RESET | D | Off | C | QT | 0 | 1 | 2 | 3 | 4 | 5 | 6 | 7 | 8 | 9 | 11 | 12 | 13 | 14 | 15 | VB | VS | 3V | Vr | A0 | R | 22 | 20 | 19 | 18 | 17 | 16 | A2 | I2C | G | 3 | RESET | D | AD2 | C | QT | 0 | 1 | 2 | 3 | 4 | 5 | 6 | 7 | 8 | 9 | 11 | 12 | 13 | 14 | 15 | GND | IO2 | IO3 | IO4 | IO5 | GND | IO6 | IO7 | IO8 | IO9 | GND | IO10 | IO11 | IO12 | IO13 | GND
Pinguin_bBackup: Under | Proto | Plate | VB | VS | 3V | Vr | A2 | A0 | R | 22 | 20 | 19 | 18 | 17 | 16 | GN | Charge Enable | GND | Chg En | CHGEN | 3V | 3.3V | Prototyping / PiCowbell | 3.7/4.2V / LiPoly Batt / USB Recharging | DA | SDA | 500mA | SCL | Cut for / 250mA | CL | 0 | 1 | 2 | 3 | 4 | 5 | 6 | 7 | 8 | 9 | 11 | 12 | 13 | 14 | 15 | VB | VS | 3V | Vr | A2 | A0 | R | 22 | 20 | 19 | 18 | 17 | 16 | GN | GND | 3V | 3.3V | Prototyping / PiCowbell | DA | SDA | SCL | CL | 0 | 1 | 2 | 3 | 4 | 5 | 6 | 7 | 8 | 9 | 11 | 12 | 13 | 14 | 15 | Bell | PiCow | StemmaQT | SCK:18,MO:19,MI:16 / D/C:20,CS:21,SDCS:17 / TSCS:15,INT:22,LITE:A0